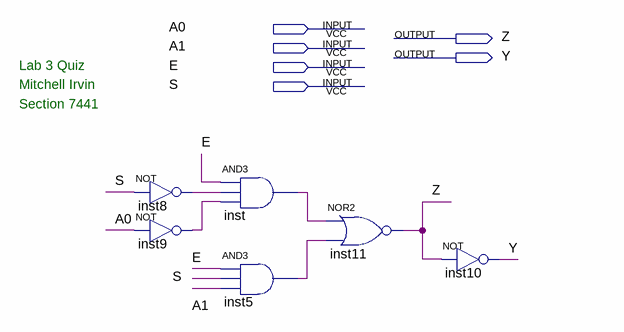
[diagram p0: schematic sheet]
// Quartus schematic lab3quiz.bdf as structural Verilog: 6 symbols, 6 pins
module lab3quiz (
  input  A0,
  input  A1,
  input  E,
  input  S,
  output Z,
  output Y
);

  wire inst5_out, inst8_out, inst9_out, inst_out;

  not inst8 (inst8_out, S);
  not inst9 (inst9_out, A0);
  and inst (inst_out, E, inst8_out, inst9_out);
  and inst5 (inst5_out, E, S, A1);
  nor inst11 (Z, inst_out, inst5_out);
  not inst10 (Y, Z);

  // Notes on the sheet:
  //   Lab 3 Quiz
  //   Mitchell Irvin
  //   Section 7441
endmodule
